# EAGLE design sd-card-male (EAGLE 9.2.0)
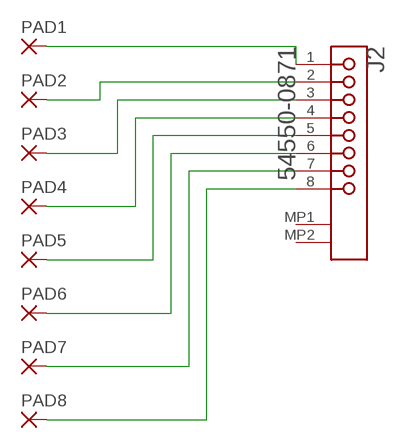
[diagram p0: schematic, sheet 1]

## Parts
J2  MOLEX_54550-0871MOLEX_54550-0871_0_0  [MOLEX_54550-0871_0]
PAD1  SD_PAD_SMD_SHORT  [SD_PAD_SMD_SHORT]
PAD2  SD_PAD_SMD_SHORT  [SD_PAD_SMD_SHORT]
PAD3  SD_PAD_SMD_SHORT  [SD_PAD_SMD_SHORT]
PAD4  SD_PAD_SMD_LONG  [SD_PAD_SMD_LONG]
PAD5  SD_PAD_SMD_SHORT  [SD_PAD_SMD_SHORT]
PAD6  SD_PAD_SMD_LONG  [SD_PAD_SMD_LONG]
PAD7  SD_PAD_SMD_SHORT  [SD_PAD_SMD_SHORT]
PAD8  SD_PAD_SMD_SHORT  [SD_PAD_SMD_SHORT]

## Nets
N$1: J2.1 PAD1.1(P)
N$2: J2.2 PAD2.1(P)
N$3: J2.3 PAD3.1(P)
N$4: J2.4 PAD4.1(P)
N$5: J2.5 PAD5.1(P)
N$6: J2.6 PAD6.1(P)
N$7: J2.7 PAD7.1(P)
N$8: J2.8 PAD8.1(P)
Unconnected: J2.MP1 J2.MP2

## Library data of the parts
J2 = Molex - 54550-0871:MOLEX_54550-0871: MOLX-54550-0871; CIIVA_IDS: 3405314; CIRCUITS_LOADED: 8; COMPONENT_LINK_1_DESCRIPTION: Manufacturer URL; COMPONENT_LINK_1_URL: http://www.molex.com/molex/index.jsp; COMPONENT_LINK_3_DESCRIPTION: Package Specification; COMPONENT_LINK_3_URL: http://www.molex.com/pdm_docs/sd/545500871_sd.pdf; CONTACT_POSITION: Top; CURRENT_MAX_PER_CONTACT: 0.5A; DATASHEET: http://www.molex.com/webdocs/datasheets/pdf/en-us/0545500871_FFC_FPC_CONNECTORS.pdf; DURABILITY_MATING_CYCLES_MAX: 20; ENTRY_ANGLE: 90degrees Angle; FOOTPRINT_VARIANT_NAME_0: Manufacturer Recommended; IMPORTED: yes; IMPORTED_FROM: vault; IMPORT_TS: 1521843996; MATED_HEIGHT: 1.20mm; MATERIAL___METAL: Phosphor Bronze; MATERIAL___PLATING_MATING: Gold; MATERIAL___PLATING_TERMINATION: Tin; MF: Molex; MOUNTING_TECHNOLOGY: Surface Mount; MPN: 54550-0871; NUMBER_OF_ROWS: 1; ORIENTATION: Right Angle; PACKAGE: 54550-0871; PACKAGE_DESCRIPTION: 8-Lead FPC Connector, Pitch 0.5 mm; PACKAGE_VERSION: Rev. M, 12/2009; PACKING: Tape and Reel; PCB_LOCATOR: No; PCB_RETENTION: Yes; PITCH___MATING_INTERFACE: 0.50mm; POLARIZED_TO_PCB: Yes; PREFIX: J; RELEASE_DATE: 1411372735; ROHS: Yes; STACKABLE: No; VAULT_GUID: 4F5E3AE4-AE0A-4DC1-8CF3-4F404F9FC512; VAULT_REVISION: F633CFB0-ED6A-4DFE-8830-DF58A16BDF03; VOLTAGE_MAX: 50V
PAD1-PAD3 PAD5 PAD7 PAD8 = sd-card-male:SD_PAD_SMD_SHORT: SMD PAD
PAD4 PAD6 = sd-card-male:SD_PAD_SMD_LONG: SMD PAD

## Board
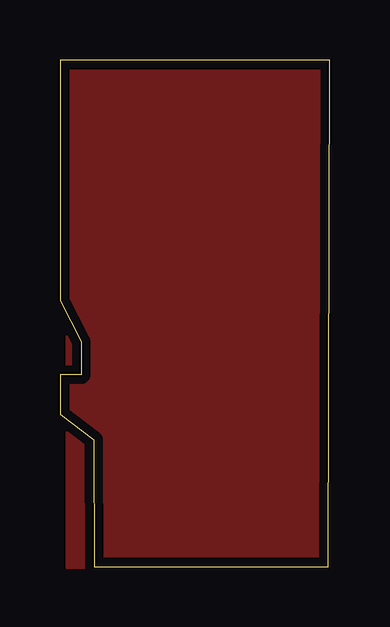
[diagram p1: board, top side]
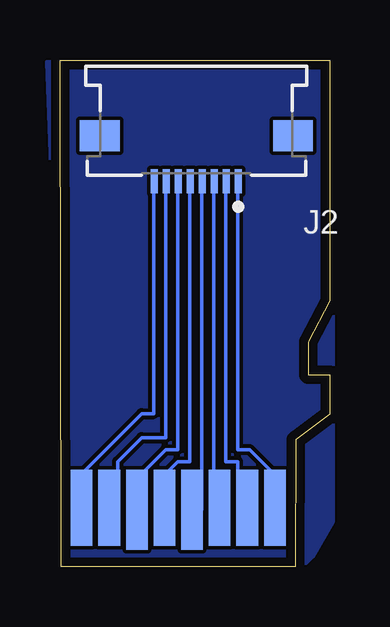
[diagram p2: board, bottom side, seen from below]

Size 11.23 x 21.12 mm. Coordinates in mm from the lower left corner, seen from the top.
Outline: 1.43,0 11.18,0 11.23,21.12 0,21.12 0,11.08 0.89,9.38 0.89,8.01 0,8.01 0,6.35 1.41,5.29 1.43,0
Copper layers (1*16): Top 0.035mm / dielectric 0.8mm / Bottom 0.035mm
Design rules "default *": minimum track width 6mil, minimum drill 0.35mm, track to track 6mil, track to pad 6mil, pad to pad 6mil, via to via 6mil, smd to smd 6mil, copper to edge 15mil, drill to drill 6mil, minimum pad ring 10mil, minimum via ring 8mil, stop-mask expansion 4mil, vias tented up to drill 0mil, thermal gap 10mil

### Footprints (pad centres in the part's own frame; a part is rotated, then mirrored left to right if it is on the bottom)
MOLEX_54550-0871_0 = smd 0.3 x 1: 1 -1.75,0.95; 2 -1.25,0.95; 3 -0.75,0.95; 4 -0.25,0.95; 5 0.25,0.95; 6 0.75,0.95; 7 1.25,0.95; 8 1.75,0.95 | smd 1.65 x 1.3: MP1 -4.025,-0.95; MP2 4.025,-0.95
SD_PAD_SMD_SHORT = smd 0.9 x 3.16: 1 -0.19,-0.6
SD_PAD_SMD_LONG = smd 0.9 x 3.33: 1 -0.19,-0.6

### Placement (x,y rotation side)
J2  5.55,17.01 180 bottom
PAD1  2.09,3.07 0 bottom
PAD2  3.24,3.07 0 bottom
PAD3  4.39,3.07 0 bottom
PAD4  5.54,2.99 0 bottom
PAD5  6.69,3.07 0 bottom
PAD6  7.84,2.99 0 bottom
PAD7  8.99,3.07 0 bottom
PAD8  10.14,3.07 0 bottom

### Tracks (layer width: path | path; a pad name or v marks a point on that pad's centre or on a via)
GND
  pour Top: 0.3,20.84 11.21,20.84 11.21,0.89 10.49,0.17 0.3,-0.04
  pour Bottom: -0.15,21.08 11.79,21.05 11.35,9.58 11.35,0.45 10.76,-0.14 1.26,-0.14 0.69,0.43 -0.15,1.9
N$1
  Bottom 0.152: J2.1 3.83,15.89 3.83,4.89 3.33,4.89 2.33,3.89 2.33,2.89 PAD1.1
N$2
  Bottom 0.152: J2.2 4.33,15.89 4.33,4.39 3.83,4.39 3.83,2.89 PAD2.1
N$3
  Bottom 0.152: J2.3 4.83,15.89 4.83,2.89 PAD3.1
N$4
  Bottom 0.152: J2.4 5.33,15.89 5.33,2.39 PAD4.1
N$5
  Bottom 0.152: J2.5 5.83,15.89 5.83,4.39 6.33,4.39 6.83,3.89 6.83,2.89 PAD5.1
N$6
  Bottom 0.152: J2.6 6.33,15.89 6.33,4.89 6.83,4.89 7.83,3.89 7.83,2.39 PAD6.1
N$7
  Bottom 0.152: J2.7 6.83,15.89 6.83,5.39 7.83,5.39 8.83,4.39 8.83,2.89 PAD7.1
N$8
  Bottom 0.152: PAD8.1 10.33,3.89 7.83,6.39 7.33,6.39 7.33,15.89 J2.8